# Altium schematic sheet Regulador.SchDoc: GRUPO ALTECH
size A3; DocumentNumber: GA0033; SheetNumber: 16; SheetTotal: 16
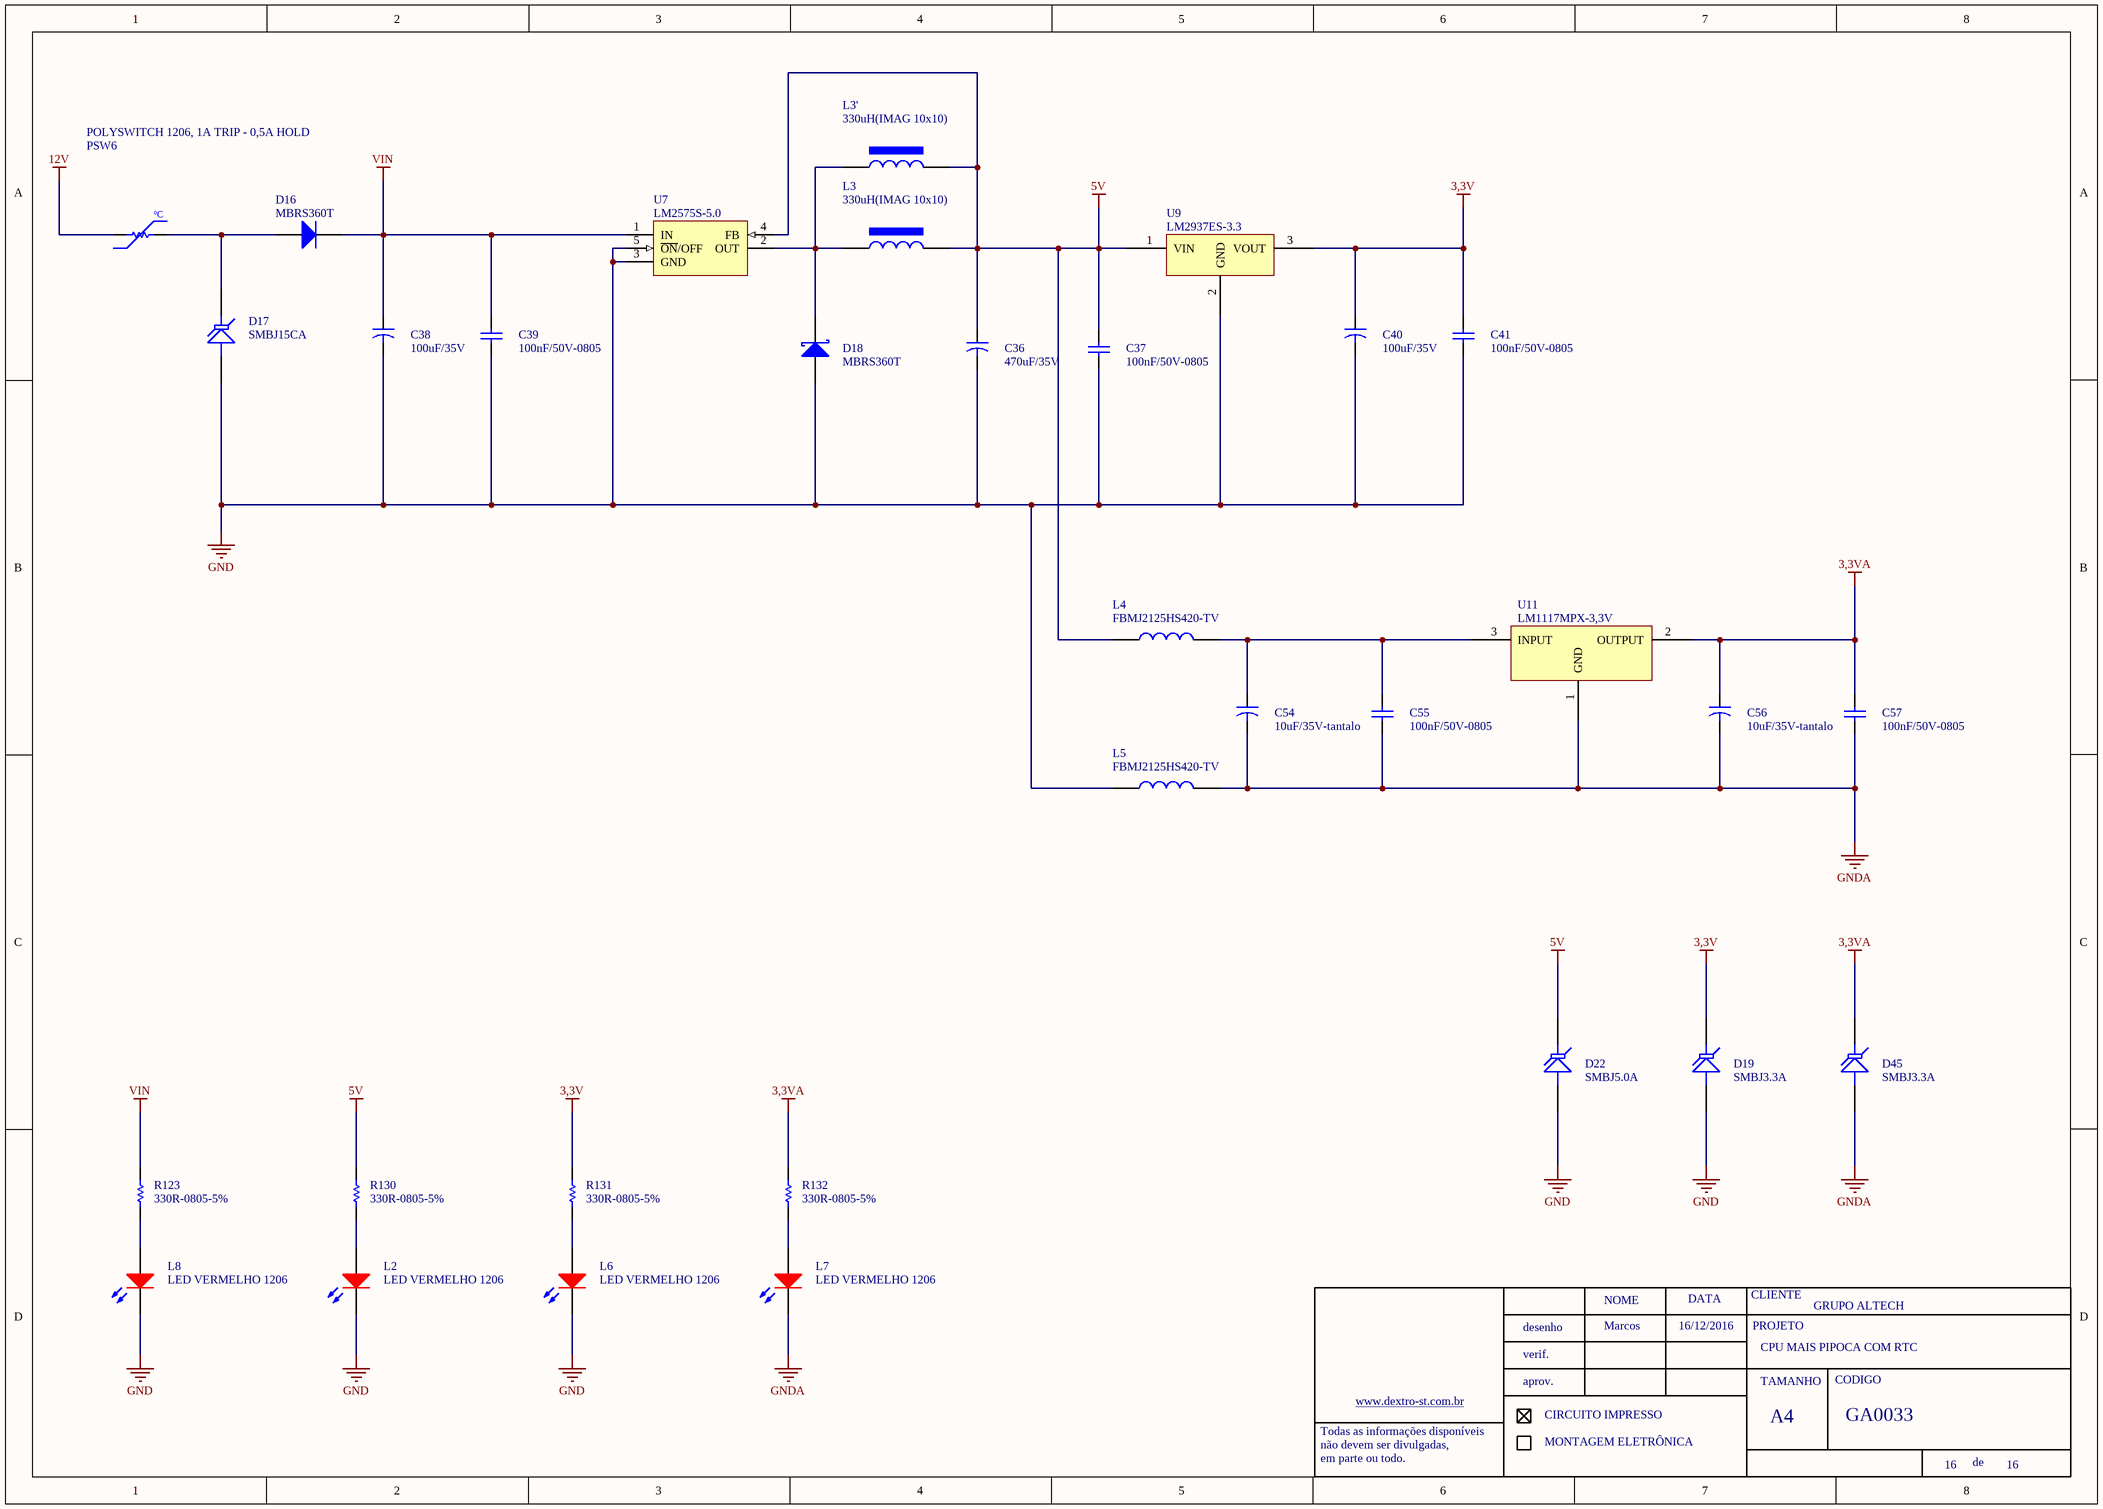
[diagram p0: Regulador.SchDoc]

## Parts
C36  470uF/35V  [CAP POL 8x12mm]
C37  100nF/50V-0805  [0805-REVISADO ONDA]
C38  100uF/35V  [CAP POL 8x12mm]
C39  100nF/50V-0805  [0805-REVISADO ONDA]
C40  100uF/35V  [CAP POL 8x12mm]
C41  100nF/50V-0805  [0805-REVISADO ONDA]
C54  10uF/35V-tantalo  [tantalo vishay E]
C55  100nF/50V-0805  [0805-REVISADO ONDA]
C56  10uF/35V-tantalo  [tantalo vishay E]
C57  100nF/50V-0805  [0805-REVISADO ONDA]
D16  MBRS360T  [DO-214AB]
D17  SMBJ15CA  [DO-214AA]
D18  MBRS360T  [DO-214AB]
D19  SMBJ3.3A  [DO-214AA]
D22  SMBJ5.0A  [DO-214AA]
D45  SMBJ3.3A  [DO-214AA]
L2  LED VERMELHO 1206  [LED 1206]
L3  330uH(IMAG 10x10)  [INDUTOR 47mH]
L3'  330uH(IMAG 10x10)  [INDUTOR 47mH]
L4  FBMJ2125HS420-TV  [0805-REVISADO ONDA]
L5  FBMJ2125HS420-TV  [0805-REVISADO ONDA]
L6  LED VERMELHO 1206  [LED 1206]
L7  LED VERMELHO 1206  [LED 1206]
L8  LED VERMELHO 1206  [LED 1206]
PSW6  POLYSWITCH 1206, 1A TRIP - 0,5A HOLD  [1206-REVISADO ONDA]
R123  330R-0805-5%  [0805-REVISADO ONDA]
R130  330R-0805-5%  [0805-REVISADO ONDA]
R131  330R-0805-5%  [0805-REVISADO ONDA]
R132  330R-0805-5%  [0805-REVISADO ONDA]
U7  LM2575S-5.0  [TO-263-5]
U9  LM2937ES-3.3  [TO-263]
U11  LM1117MPX-3,3V  [SOT223]

## Nets
3,3V: C40.1 C41.2 D19.2(K) R131.2 U9.3(VOUT)
3,3VA: C56.1 C57.2 D45.2(K) R132.2 U11.2(OUTPUT)
5V: C36.1 C37.2 D22.2(K) L3.1 L3'.1 L4.1 R130.2 U7.4(FB) U9.1(VIN)
12V: PSW6.1
GND: C36.2 C37.1 C38.2 C39.1 C40.2 C41.1 D17.1(A) D18.1(A) D19.1(A) D22.1(A) L2.2(K) L5.1 L6.2(K) L8.2(K) U7.3(GND) U7.5(~{ON}/OFF) U9.2(GND)
GNDA: C54.2 C55.1 C56.2 C57.1 D45.1(A) L5.2 L7.2(K) U11.1(GND)
VIN: C38.1 C39.2 D16.2(K) R123.2 U7.1(IN)
NetC54_1: C54.1 C55.2 L4.2 U11.3(INPUT)
NetD16_1: D16.1(A) D17.2(K) PSW6.2
NetD18_2: D18.2(K) L3.2 L3'.2 U7.2(OUT)
NetL2_1: L2.1(A) R130.1
NetL6_1: L6.1(A) R131.1
NetL7_1: L7.1(A) R132.1
NetL8_1: L8.1(A) R123.1

## Notes on the sheet
- Marcos
- 16/12/2016
- CPU MAIS PIPOCA COM RTC
- NOME
- DATA
- CLIENTE
- PROJETO
- desenho
- verif.
- aprov.
- TAMANHO
- CODIGO
- Todas as informações disponíveis
- não devem ser divulgadas,
- em parte ou todo.
- www.dextro-st.com.br
- CIRCUITO IMPRESSO
- MONTAGEM ELETRÔNICA
- A4
- de
- (in symbol PTC 2A-120V) ºC

## Library data of the parts
C36 C38 C40 = 100uF/50V: ERP: 105.01.003
C37 C39 C41 C55 C57 = 100nF/50-0805-NPO: ERP: 104.11.005
D16 = 1N4007: ERP: 120.18.001
D17 = SMBJ30.0A: ERP: 128.02.003
D18 = 1N5819-SOD80: ERP: 121.18.003
D19 D45 = SMBJ5.0A: ERP: 128.02.002
L2 L6-L8 = LED VERMELHO 0603 SMD: ERP: 124.02.010
L3 L3' = indutor 1mH CNF15: 1mH-CNF15-26 AWG; ERP: 211.00.012
L4 L5 = FERRITE BEAD 2K7-100MHZ - 200 mA - 800mOHM DC
PSW6 = PTC 2A-120V
R123 R130-R132 = 1K-0805-5%: ERP: 102.11.042
U9 = LM3940IT-3.3-TO220: LM2937; ERP: 115.01.001
U11 = LM1117MPX-3,3V-SOT223: ERP: 115.01.011
C54 C56 = 10uF/35V-tantalo: ERP: 104.11.011
D22 = SMBJ5.0A: ERP: 128.02.002
U7 = LM2575S-5.0: ERP: 115.01.020